# EAGLE schematic schema (EAGLE 9.6.2)
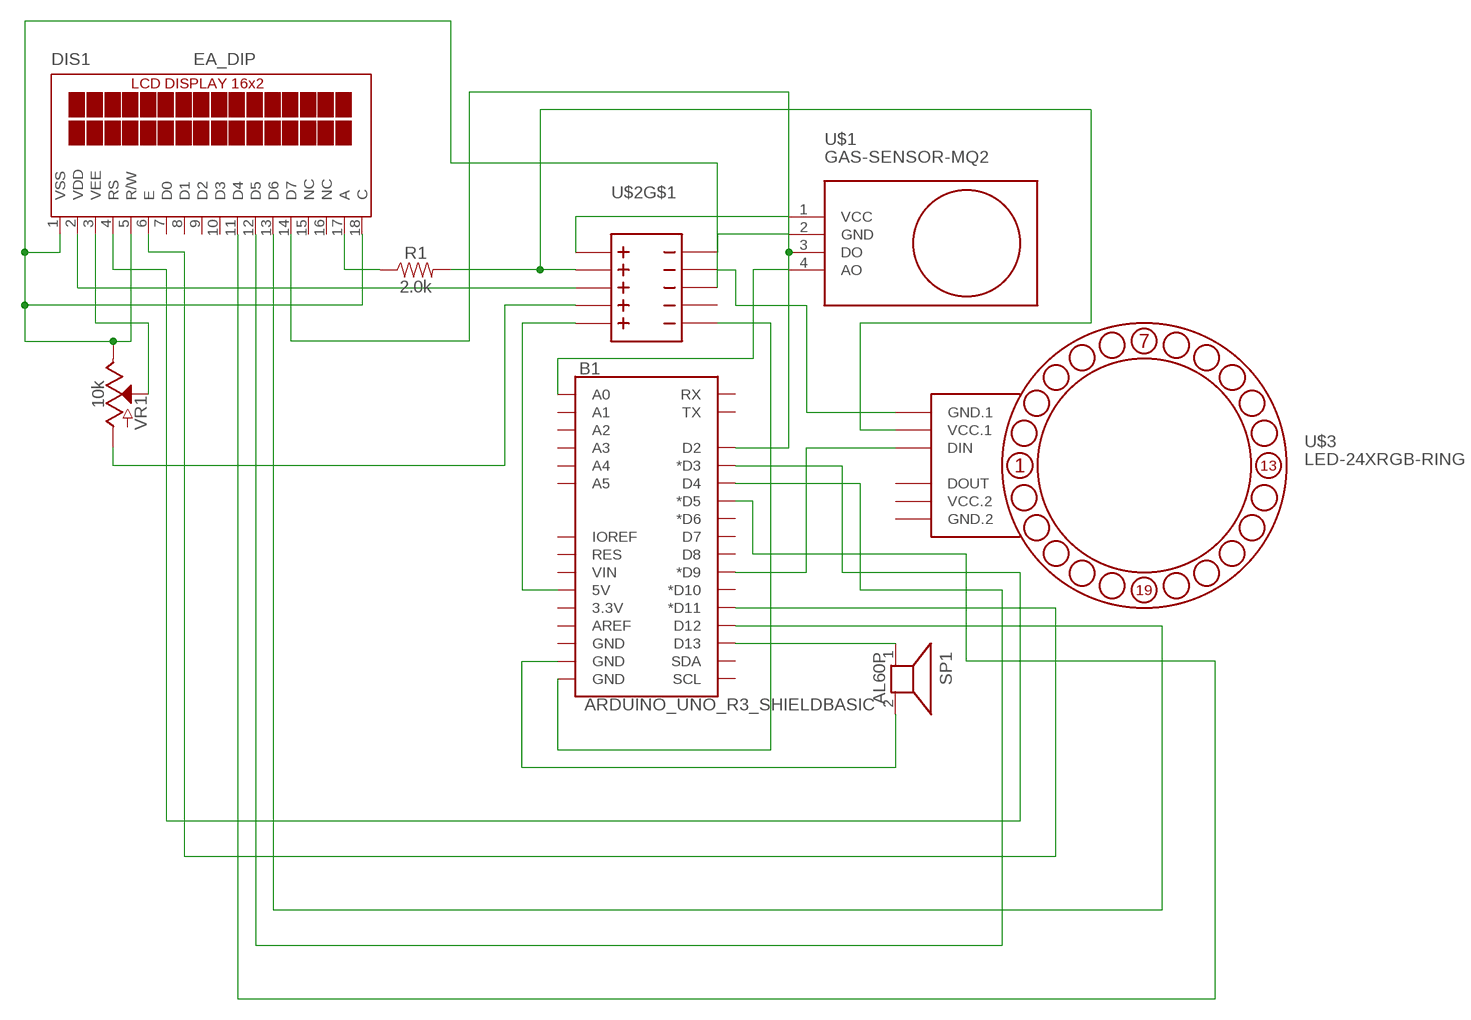
[diagram p0: schematic, sheet 1]

## Parts
B1  ARDUINO_UNO_R3_SHIELDBASIC  [UNO_R3_SHIELD]
DIS1  EA_DIP  [EA_DIP]
R1  2.0k  2.0KOHM-0603-1/10W-5%  [0603]
SP1  AL60P  [AL60P]
U$1  GAS-SENSOR-MQ2  [GAS-SENSOR-MQ2]
U$2  BREADBOARD-POWER-V1  [BREADBOARD-POWER-V1]
U$3  LED-24XRGB-RING  [LED-24XRGB-RING]
VR1  10k  POTENTIOMETER-PTH-9MM-1/20W-20%  [POT-PTH-ALPS]

## Nets
N$1: B1.5V U$2.A.P.5(P.5)
N$2: B1.GND@0(GND) U$2.A.M.5(M.5)
N$3: U$1.1(VCC) U$2.A.P.1(P.1)
N$4: U$1.2(GND) U$2.A.M.1(M.1)
N$5: B1.A0 U$1.4(AO)
N$6: B1.D13 SP1.1
N$7: B1.GND@1(GND) SP1.2
N$8: U$2.A.M.2(M.2) U$3.1(GND.1)
N$9: R1.2 U$2.A.P.2(P.2) U$3.2(VCC.1)
N$10: B1.D9(*D9) U$3.3(DIN)
N$11: DIS1.1(VSS) DIS1.5(R/W) DIS1.18(C) U$2.A.M.3(M.3) VR1.P$1(E)
N$12: DIS1.17(A) R1.1
N$13: U$2.A.P.4(P.4) VR1.P$3(A)
N$14: DIS1.3(VEE) VR1.P$2(S)
N$15: B1.D3(*D3) B1.D12 DIS1.4(RS) DIS1.13(D6)
N$16: B1.D11(*D11) DIS1.6(E)
N$17: B1.D4 DIS1.12(D5)
N$18: B1.D2 DIS1.14(D7) U$1.3(DO)
N$19: B1.D5(*D5) DIS1.11(D4)
N$20: DIS1.2(VDD) U$2.A.P.3(P.3)
Unconnected: B1.3.3V B1.A1 B1.A2 B1.A3 B1.A4 B1.A5 B1.AREF B1.D6(*D6) B1.D7 B1.D8 B1.D10(*D10) B1.GND@2(GND) B1.IOREF B1.RES B1.RX B1.SCL B1.SDA B1.TX B1.VIN DIS1.7(D0) DIS1.8(D1) DIS1.9(D2) DIS1.10(D3) DIS1.15(NC) DIS1.16(NC) U$2.A.M.4(M.4) U$2.B.M.1(M.1) U$2.B.M.2(M.2) U$2.B.M.3(M.3) U$2.B.M.4(M.4) U$2.B.M.5(M.5) U$2.B.P.1(P.1) U$2.B.P.2(P.2) U$2.B.P.3(P.3) U$2.B.P.4(P.4) U$2.B.P.5(P.5) U$3.4(DOUT)

## Power pins joined to a net without a drawn wire
GND.2: U$3.6(GND.2)
VCC.2: U$3.5(VCC.2)

## Library data of the parts
B1 = SparkFun-Boards:ARDUINO_UNO_R3_SHIELD: Arduino R3 Shield Footprint Shield form compatible with the Arduino Uno R3. SparkFun Products: MG2639 Cellular Shield <https://www.sparkfun.com/products/13120> MIDI Shield <https://www.sparkfun.com/products/12898> R3 Stackable Headers Kit <https://www.sparkfun.com/products/11417>
DIS1 = display-lcd:EA_DIP: LCD-MODUL 2x16 - 6,68mm, INKL. KONTROLLER HD44780 Source: Data sheet <http://www.lcd-module.de/pdf/doma/dip162-d.pdf>
R1 = SparkFun-Resistors:2.0KOHM: 2kΩ resistor A resistor is a passive two-terminal electrical component that implements electrical resistance as a circuit element. Resistors act to reduce current flow, and, at the same time, act to lower voltage levels within circuits. - Wikipedia; PROD_ID: RES-08296
SP1 = buzzer:AL60P: SPEAKER Source: Buerklin; OC_FARNELL: unknown; OC_NEWARK: unknown
U$1 = diy-modules:GAS-SENSOR-MQ2: Gas Sensor based on MQ-2 device Guide describing how to use MQ-2 sensor with Arduino is available here: http://www.instructables.com/id/How-to-use-MQ2-Gas-Sensor-Arduino-Tutorial/ MQ-2 sensor datasheet is available here: http://gas-sensor.ru/pdf/combustible-gas-sensor.pdf Click here to find device on ebay.com <http://www.ebay.com/sch/mq2+sensor+module+smoke>
U$2 = diy-modules:BREADBOARD-POWER-V1: Breadboard Power Adapter with onboard 3.3V and 5V regulators
U$3 = diy-modules:LED-24XRGB-RING: 24 LEDs RGB Ring based on WS2812B More details about controlling WS2812B RGB LEDs are available here: https://learn.sparkfun.com/tutorials/ws2812-breakout-hookup-guide Click here to find device on ebay.com <http://www.ebay.com/sch/ws2812+24+bit+ring>
VR1 = SparkFun-Resistors:POTENTIOMETER: Potentiometer (Pot) Three-terminal potentiometers, with an adjustable wiper and two adjustable resistors. A pot can be used to create a configurable voltage divider, or as a variable resistor. Variants ALPS_POT and ALPS_POT_KIT - PTH, breadboard compatible, 9mm square pots Rotary Potentiometer - Linear (10k ohm) <https://www.sparkfun.com/products/9288> (COM-09288) The KIT variant exposes copper on only one side of the PTH pad, so the part can only be assembled on one side of the PCB. Useful for beginner soldering kits.; PROD_ID: RES-09177; SF_SKU: COM-09288

## Module MQ
Ports: 

### Library data of the parts